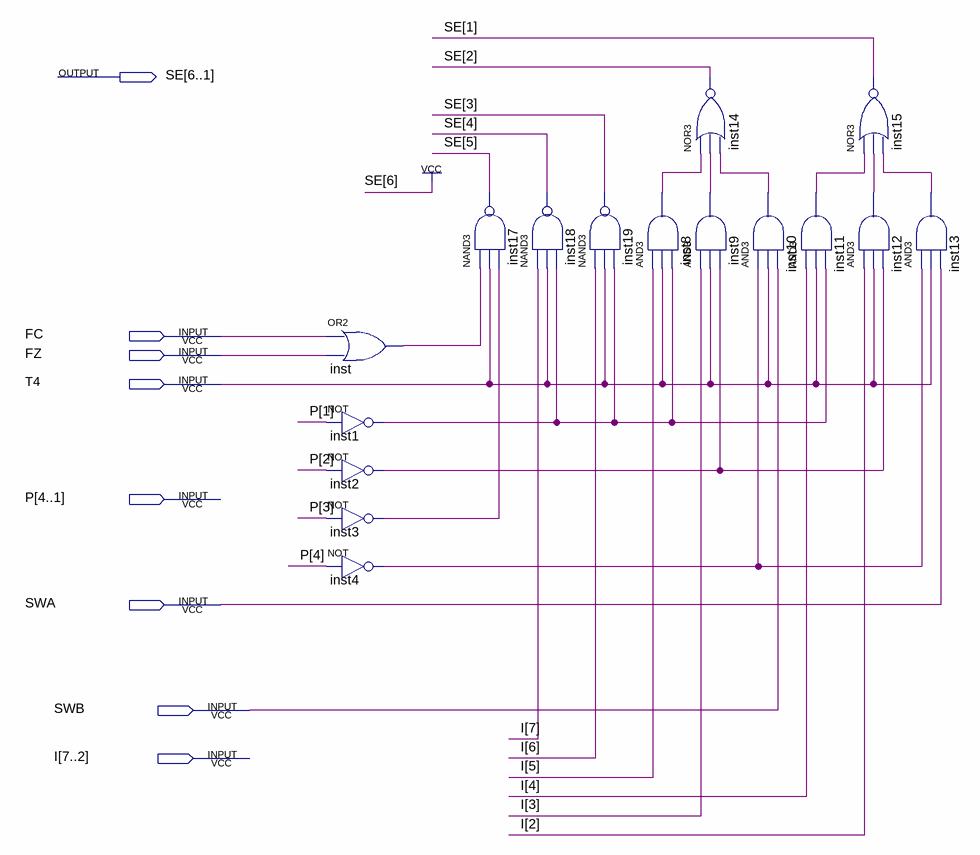
[diagram p0: schematic sheet]
// Quartus schematic shiyan1.bdf as structural Verilog: 16 symbols, 8 pins
module shiyan1 (
  input  FC,
  input  FZ,
  input  T4,
  input  [4:1] P,
  input  SWA,
  input  SWB,
  input  [7:2] I,
  output [6:1] SE
);

  wire inst1_out, inst2_out, inst3_out, inst4_out, inst8_out, inst9_out, inst10_out, inst11_out, inst12_out,
       inst13_out, inst_out;

  or inst (inst_out, FC, FZ);
  not inst1 (inst1_out, P[1]);
  not inst2 (inst2_out, P[2]);
  not inst3 (inst3_out, P[3]);
  not inst4 (inst4_out, P[4]);
  nand inst17 (SE[5], inst_out, T4, inst3_out);
  nand inst18 (SE[4], I[7], T4, inst1_out);
  and inst8 (inst8_out, I[5], T4, inst1_out);
  nand inst19 (SE[3], I[6], T4, inst1_out);
  nor inst14 (SE[2], inst8_out, inst9_out, inst10_out);
  and inst9 (inst9_out, I[3], T4, inst2_out);
  and inst10 (inst10_out, inst4_out, T4, SWB);
  and inst11 (inst11_out, I[4], T4, inst1_out);
  nor inst15 (SE[1], inst11_out, inst12_out, inst13_out);
  and inst12 (inst12_out, I[2], T4, inst2_out);
  and inst13 (inst13_out, inst4_out, T4, SWA);

  assign SE[6] = 1'b1;
endmodule
